# EAGLE design 100x75 BOB (EAGLE 9.6.2)
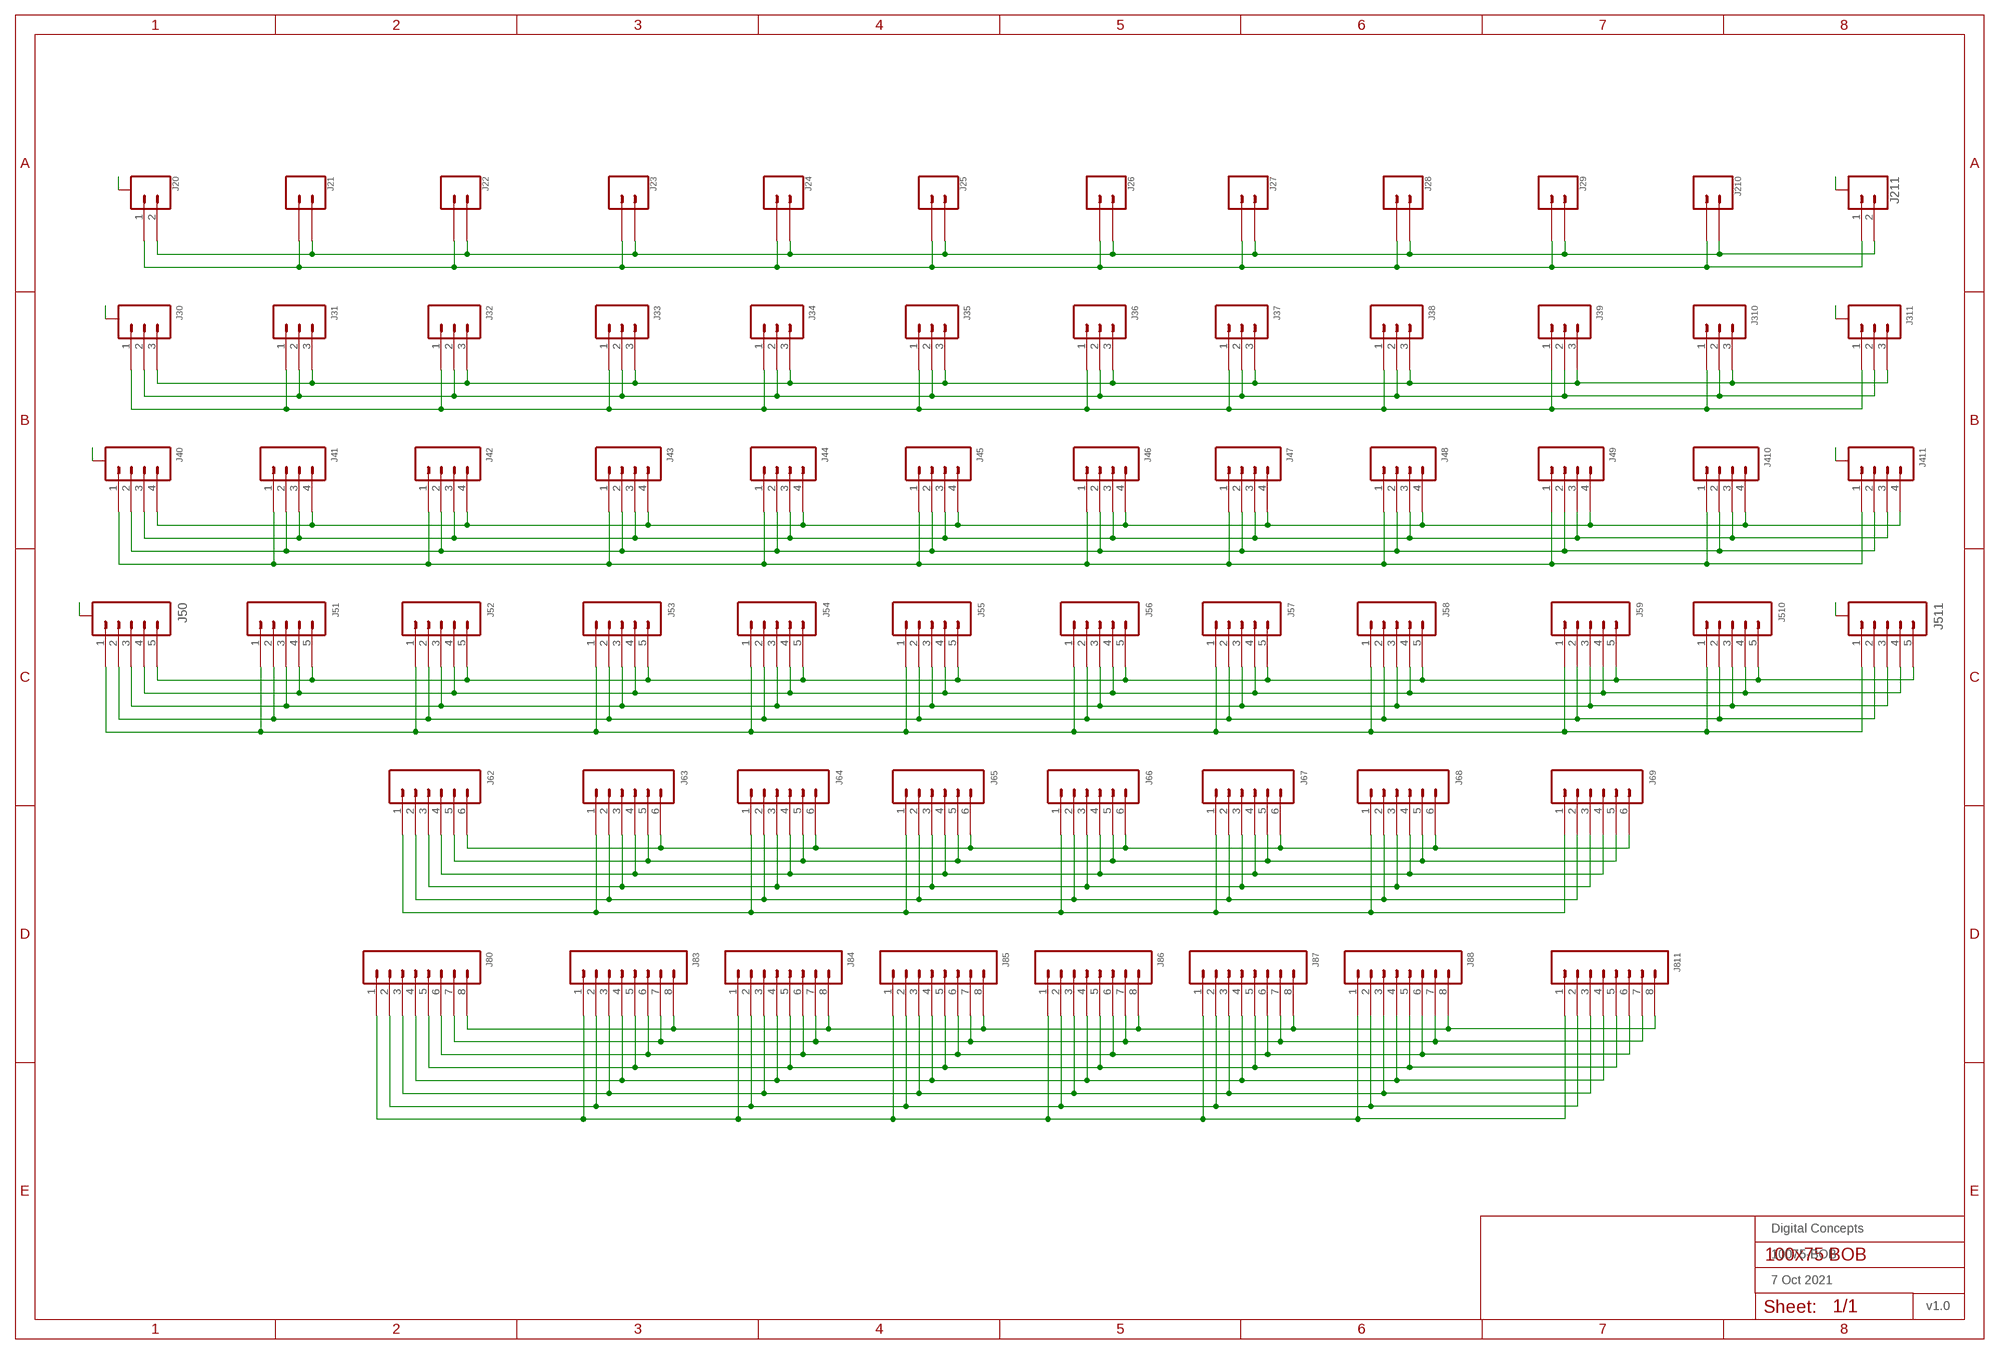
[diagram p0: schematic, sheet 1]
FRAME1 (FRAME-A3L-LOC): DATE: 7 Oct 2021; OWNER: Digital Concepts; TITLE: 10075-BOB; VERSION: v1.0

## Parts
J20  JST-SH1.0-2-SMD-VERTICAL  [JST-SH1.0-2-VERTICAL]
J21  JST-GH1.25-2-VERTICAL  [JST-GH1.25-2-VERTICAL]
J22  JST-PH2.0-2-VERTICAL  [JST-PH2.0-2-VERTICAL]
J23  HEADER-1X2-GENERIC  [CONN_02-GENERIC]
J24  HEADER-1X2-GENERIC  [CONN_02-GENERIC]
J25  HEADER-1X2-GENERIC  [CONN_02-GENERIC]
J26  HEADER-1X2-GENERIC  [CONN_02-GENERIC]
J27  HEADER-1X2-GENERIC  [CONN_02-GENERIC]
J28  HEADER-1X2-GENERIC  [CONN_02-GENERIC]
J29  JST-PH2.0-2-VERTICAL  [JST-PH2.0-2-VERTICAL]
J30  JST-SH1.0-3-SMD-VERTICAL  [JST-SH1.0-3-VERTICAL]
J31  JST-GH1.25-3-VERTICAL  [JST-GH1.25-3-VERTICAL]
J32  JST-PH2.0-3-VERTICAL  [JST-PH2.0-3-VERTICAL]
J33  HEADER-1X3-GENERIC  [CONN_03-GENERIC]
J34  HEADER-1X3-GENERIC  [CONN_03-GENERIC]
J35  HEADER-1X3-GENERIC  [CONN_03-GENERIC]
J36  HEADER-1X3-GENERIC  [CONN_03-GENERIC]
J37  HEADER-1X3-GENERIC  [CONN_03-GENERIC]
J38  HEADER-1X3-GENERIC  [CONN_03-GENERIC]
J39  JST-PH2.0-3-VERTICAL  [JST-PH2.0-3-VERTICAL]
J40  JST-SH1.0-4-SMD-VERTICAL  [JST-SH1.0-4-VERTICAL]
J41  JST-GH1.25-4-VERTICAL  [JST-GH1.25-4-VERTICAL]
J42  JST-PH2.0-4-VERTICAL  [JST-PH2.0-4-VERTICAL]
J43  HEADER-1X4-GENERIC  [CONN_04-GENERIC]
J44  HEADER-1X4-GENERIC  [CONN_04-GENERIC]
J45  HEADER-1X4-GENERIC  [CONN_04-GENERIC]
J46  HEADER-1X4-GENERIC  [CONN_04-GENERIC]
J47  HEADER-1X4-GENERIC  [CONN_04-GENERIC]
J48  HEADER-1X4-GENERIC  [CONN_04-GENERIC]
J49  JST-PH2.0-4-VERTICAL  [JST-PH2.0-4-VERTICAL]
J50  JST-SH1.0-5-SMD-VERTICAL  [JST-SH1.0-5-VERTICAL]
J51  JST-GH1.25-5-VERTICAL  [JST-GH1.25-5-VERTICAL]
J52  JST-PH2.0-5-VERTICAL  [JST-PH2.0-5-VERTICAL]
J53  HEADER-1X5-GENERIC  [CONN_05-GENERIC]
J54  HEADER-1X5-GENERIC  [CONN_05-GENERIC]
J55  HEADER-1X5-GENERIC  [CONN_05-GENERIC]
J56  HEADER-1X5-GENERIC  [CONN_05-GENERIC]
J57  HEADER-1X5-GENERIC  [CONN_05-GENERIC]
J58  HEADER-1X5-GENERIC  [CONN_05-GENERIC]
J59  JST-PH2.0-5-VERTICAL  [JST-PH2.0-5-VERTICAL]
J62  RJ11-6P6C-VERTICAL  [RJ11-6-VERTICAL]
J63  HEADER-1X6-GENERIC  [CONN_06-GENERIC]
J64  HEADER-1X6-GENERIC  [CONN_06-GENERIC]
J65  HEADER-1X6-GENERIC  [CONN_06-GENERIC]
J66  HEADER-1X6-GENERIC  [CONN_06-GENERIC]
J67  HEADER-1X6-GENERIC  [CONN_06-GENERIC]
J68  HEADER-1X6-GENERIC  [CONN_06-GENERIC]
J69  RJ11-6P6C-VERTICAL  [RJ11-6-VERTICAL]
J80  RJ45-8P8C-VERTICAL  [RJ45-VERTICAL]
J83  HEADER-1X8-GENERIC  [CONN_08-GENERIC]
J84  HEADER-1X8-GENERIC  [CONN_08-GENERIC]
J85  HEADER-1X8-GENERIC  [CONN_08-GENERIC]
J86  HEADER-1X8-GENERIC  [CONN_08-GENERIC]
J87  HEADER-1X8-GENERIC  [CONN_08-GENERIC]
J88  HEADER-1X8-GENERIC  [CONN_08-GENERIC]
J210  JST-GH1.25-2-VERTICAL  [JST-GH1.25-2-VERTICAL]
J211  JST-SH1.0-2-SMD-VERTICAL  [JST-SH1.0-2-VERTICAL]
J310  JST-GH1.25-3-VERTICAL  [JST-GH1.25-3-VERTICAL]
J311  JST-SH1.0-3-SMD-VERTICAL  [JST-SH1.0-3-VERTICAL]
J410  JST-GH1.25-4-VERTICAL  [JST-GH1.25-4-VERTICAL]
J411  JST-SH1.0-4-SMD-VERTICAL  [JST-SH1.0-4-VERTICAL]
J510  JST-GH1.25-5-VERTICAL  [JST-GH1.25-5-VERTICAL]
J511  JST-SH1.0-5-SMD-VERTICAL  [JST-SH1.0-5-VERTICAL]
J811  RJ45-8P8C-VERTICAL  [RJ45-VERTICAL]

## Nets
A: J20.A@1(A) J20.A@2(A) J30.A@1(A) J30.A@3(A) J40.A@1(A) J40.A@4(A) J50.A@1(A) J50.A@5(A) J211.A@1(A) J211.A@2(A) J311.A@1(A) J311.A@3(A) J411.A@1(A) J411.A@4(A) J511.A@1(A) J511.A@5(A)
N$1: J20.1 J21.1 J22.1 J23.1 J24.1 J25.1 J26.1 J27.1 J28.1 J29.1 J210.1 J211.1
N$2: J30.3 J31.3 J32.3 J33.3 J34.3 J35.3 J36.3 J37.3 J38.3 J39.3 J310.3 J311.3
N$3: J30.2 J31.2 J32.2 J33.2 J34.2 J35.2 J36.2 J37.2 J38.2 J39.2 J310.2 J311.2
N$4: J30.1 J31.1 J32.1 J33.1 J34.1 J35.1 J36.1 J37.1 J38.1 J39.1 J310.1 J311.1
N$5: J80.8 J83.8 J84.8 J85.8 J86.8 J87.8 J88.8 J811.8
N$6: J80.7 J83.7 J84.7 J85.7 J86.7 J87.7 J88.7 J811.7
N$7: J20.2 J21.2 J22.2 J23.2 J24.2 J25.2 J26.2 J27.2 J28.2 J29.2 J210.2 J211.2
N$8: J80.6 J83.6 J84.6 J85.6 J86.6 J87.6 J88.6 J811.6
N$9: J80.5 J83.5 J84.5 J85.5 J86.5 J87.5 J88.5 J811.5
N$10: J80.4 J83.4 J84.4 J85.4 J86.4 J87.4 J88.4 J811.4
N$11: J80.3 J83.3 J84.3 J85.3 J86.3 J87.3 J88.3 J811.3
N$12: J80.2 J83.2 J84.2 J85.2 J86.2 J87.2 J88.2 J811.2
N$13: J80.1 J83.1 J84.1 J85.1 J86.1 J87.1 J88.1 J811.1
N$14: J62.6 J63.6 J64.6 J65.6 J66.6 J67.6 J68.6 J69.6
N$15: J62.5 J63.5 J64.5 J65.5 J66.5 J67.5 J68.5 J69.5
N$16: J62.4 J63.4 J64.4 J65.4 J66.4 J67.4 J68.4 J69.4
N$17: J62.3 J63.3 J64.3 J65.3 J66.3 J67.3 J68.3 J69.3
N$18: J62.2 J63.2 J64.2 J65.2 J66.2 J67.2 J68.2 J69.2
N$19: J62.1 J63.1 J64.1 J65.1 J66.1 J67.1 J68.1 J69.1
N$20: J40.1 J41.1 J42.1 J43.1 J44.1 J45.1 J46.1 J47.1 J48.1 J49.1 J410.1 J411.1
N$21: J40.2 J41.2 J42.2 J43.2 J44.2 J45.2 J46.2 J47.2 J48.2 J49.2 J410.2 J411.2
N$22: J40.3 J41.3 J42.3 J43.3 J44.3 J45.3 J46.3 J47.3 J48.3 J49.3 J410.3 J411.3
N$23: J40.4 J41.4 J42.4 J43.4 J44.4 J45.4 J46.4 J47.4 J48.4 J49.4 J410.4 J411.4
N$25: J50.4 J51.4 J52.4 J53.4 J54.4 J55.4 J56.4 J57.4 J58.4 J59.4 J510.4 J511.4
N$26: J50.3 J51.3 J52.3 J53.3 J54.3 J55.3 J56.3 J57.3 J58.3 J59.3 J510.3 J511.3
N$27: J50.2 J51.2 J52.2 J53.2 J54.2 J55.2 J56.2 J57.2 J58.2 J59.2 J510.2 J511.2
N$28: J50.1 J51.1 J52.1 J53.1 J54.1 J55.1 J56.1 J57.1 J58.1 J59.1 J510.1 J511.1
N$30: J50.5 J51.5 J52.5 J53.5 J54.5 J55.5 J56.5 J57.5 J58.5 J59.5 J510.5 J511.5

## Library data of the parts
J20 J211 = digitalconcepts:JST-SH1.0-2-SMD-VERTICAL: JST SH1.0 2P SMD Vertical Connector
J21 J210 = digitalconcepts:JST-GH1.25-2-VERTICAL: JST GH1.25 2P PTH Connector
J22 J29 = digitalconcepts:JST-PH2.0-2-VERTICAL: PH2.0 2P Vertical Connector
J23-J28 = digitalconcepts:HEADER-1X2-GENERIC: Single Row 2-Pin Header
J30 J311 = digitalconcepts:JST-SH1.0-3-SMD-VERTICAL: JST SH1.0 3P SMD Vertical Connector
J31 J310 = digitalconcepts:JST-GH1.25-3-VERTICAL: SH1.25 3P Male PTH Connector
J32 J39 = digitalconcepts:JST-PH2.0-3-VERTICAL: PH2.0 3P Vertical Connector
J33-J38 = digitalconcepts:HEADER-1X3-GENERIC: Single Row 3-Pin Header
J40 J411 = digitalconcepts:JST-SH1.0-4-SMD-VERTICAL: JST SH1.0 SMD 4P vertical connector
J41 J410 = digitalconcepts:JST-GH1.25-4-VERTICAL: SH1.25 4P Male PTH Connector
J42 J49 = digitalconcepts:JST-PH2.0-4-VERTICAL: PH2.0 4P Vertical Connector
J43-J48 = digitalconcepts:HEADER-1X4-GENERIC: Single Row 4-Pin Header
J50 J511 = digitalconcepts:JST-SH1.0-5-SMD-VERTICAL: JST SH1.0 5P SMD Vertical Connector
J51 J510 = digitalconcepts:JST-GH1.25-5-VERTICAL: SH1.25 5P Male PTH Connector
J52 J59 = digitalconcepts:JST-PH2.0-5-VERTICAL: PH2.0 5P Vertical Connector
J53-J58 = digitalconcepts:HEADER-1X5-GENERIC: Single Row 5-Pin Header
J62 J69 = digitalconcepts:RJ11-6P6C-VERTICAL: RJ11-6P6C-Vertical PCB Socket
J63-J68 = digitalconcepts:HEADER-1X6-GENERIC: Single Row 6-Pin Header
J80 J811 = digitalconcepts:RJ45-8P8C-VERTICAL: RJ45-8P8C-Vertical PCB Socket
J83-J88 = digitalconcepts:HEADER-1X8-GENERIC: Single Row 8-Pin Header

## Board
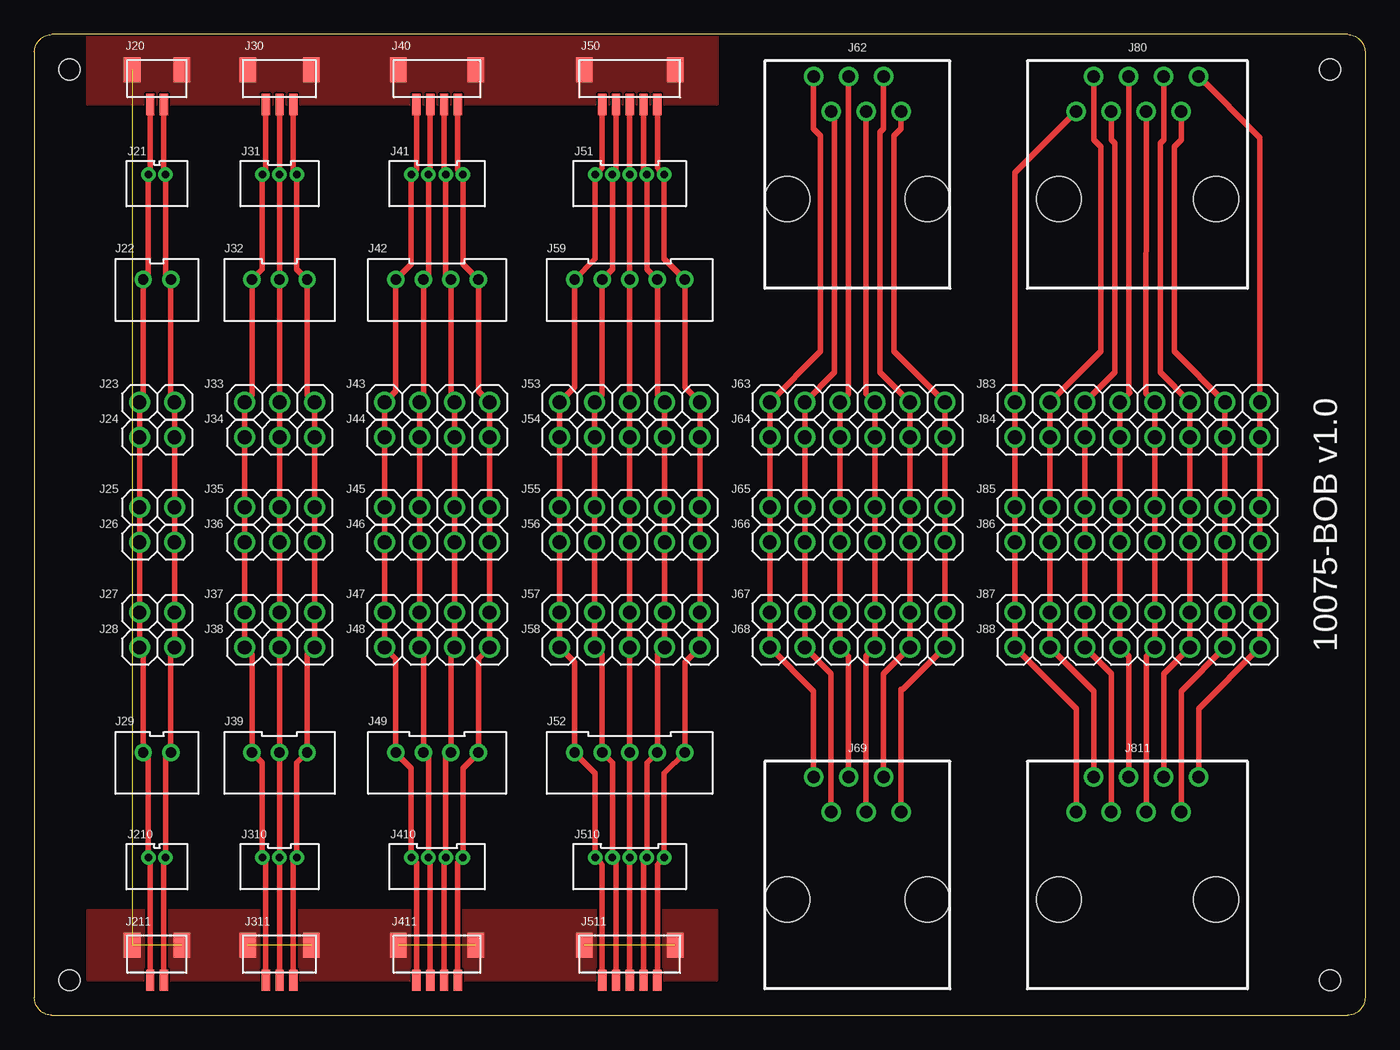
[diagram p1: board, top side]
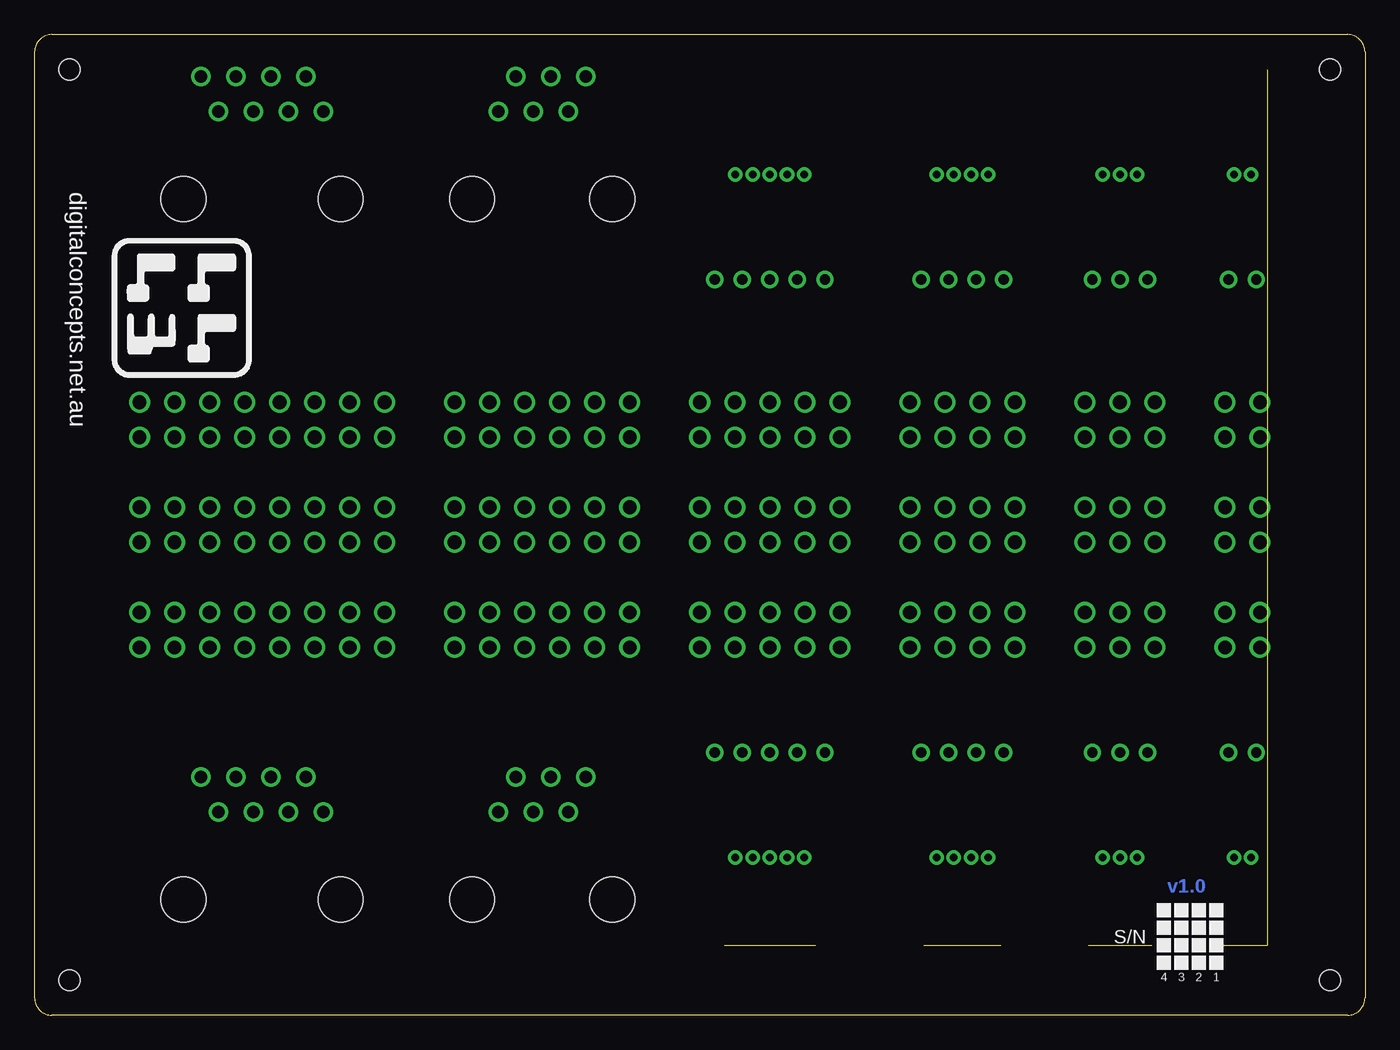
[diagram p2: board, bottom side, seen from below]

Size 96.52 x 71.12 mm. Coordinates in mm from the lower left corner, seen from the top.
Outline: 95.25,71.12 arc-90 96.52,69.85 96.52,1.27 arc-90 95.25,0 1.27,0 arc-90 0,1.27 0,69.85 arc-90 1.27,71.12 95.25,71.12
Copper layers (1*16): Top 0.035mm / dielectric 1.5mm / Bottom 0.035mm
Design rules "default *": minimum track width 6mil, minimum drill 0.35mm, track to track 6mil, track to pad 6mil, pad to pad 6mil, via to via 6mil, smd to smd 6mil, copper to edge 6mil, drill to drill 6mil, minimum pad ring 10mil, minimum via ring 8mil, stop-mask expansion 4mil, vias tented up to drill 0mil, thermal gap 0mil
Holes 1.52 mm at 2.54,68.58 2.54,2.54 93.98,2.54 93.98,68.58

### Footprints (pad centres in the part's own frame; a part is rotated, then mirrored left to right if it is on the bottom)
JST-SH1.0-2-VERTICAL = smd 0.6 x 1.55: 1 -0.5,-2.54; 2 0.5,-2.54 | smd 1.2 x 1.8: A@1 -1.8,-0.015; A@2 1.8,-0.015
JST-GH1.25-2-VERTICAL = drill 0.55 pad 1.016: 1 -0.625,0; 2 0.625,0
JST-PH2.0-2-VERTICAL = drill 0.75: 1 -1,0; 2 1,0
CONN_02-GENERIC = drill 1 pad 1.524: 1 0,0; 2 2.54,0
JST-SH1.0-3-VERTICAL = smd 0.6 x 1.55: 1 -1,-2.54; 2 0,-2.54; 3 1,-2.54 | smd 1.2 x 1.8: A@1 -2.3,-0.015; A@3 2.3,-0.015
JST-GH1.25-3-VERTICAL = drill 0.55 pad 1.016: 1 -1.25,0; 2 0,0; 3 1.25,0
JST-PH2.0-3-VERTICAL = drill 0.75: 1 -2,0; 2 0,0; 3 2,0
CONN_03-GENERIC = drill 1 pad 1.524: 1 0,0; 2 2.54,0; 3 5.08,0
JST-SH1.0-4-VERTICAL = smd 0.6 x 1.55: 1 -1.5,-2.54; 2 -0.5,-2.54; 3 0.5,-2.54; 4 1.5,-2.54 | smd 1.2 x 1.8: A@1 -2.8,-0.015; A@4 2.8,-0.015
JST-GH1.25-4-VERTICAL = drill 0.55 pad 1.016: 1 -1.875,0; 2 -0.625,0; 3 0.625,0; 4 1.875,0
JST-PH2.0-4-VERTICAL = drill 0.75: 1 -3,0; 2 -1,0; 3 1,0; 4 3,0
CONN_04-GENERIC = drill 1 pad 1.524: 1 0,0; 2 2.54,0; 3 5.08,0; 4 7.62,0
JST-SH1.0-5-VERTICAL = smd 0.6 x 1.55: 1 -2,-2.54; 2 -1,-2.54; 3 0,-2.54; 4 1,-2.54; 5 2,-2.54 | smd 1.2 x 1.8: A@1 -3.3,-0.015; A@5 3.3,-0.015
JST-GH1.25-5-VERTICAL = drill 0.55 pad 1.016: 1 -2.5,0; 2 -1.25,0; 3 0,0; 4 1.25,0; 5 2.5,0
JST-PH2.0-5-VERTICAL = drill 0.75: 1 -4,0; 2 -2,0; 3 0,0; 4 2,0; 5 4,0
CONN_05-GENERIC = drill 1 pad 1.524: 1 0,0; 2 2.54,0; 3 5.08,0; 4 7.62,0; 5 10.16,0
RJ11-6-VERTICAL = drill 0.9: 1 -3.175,7.12; 2 -1.905,4.58; 3 -0.635,7.12; 4 0.635,4.58; 5 1.905,7.12; 6 3.175,4.58 | hole 3.25: -5.08,-1.77; 5.08,-1.77
CONN_06-GENERIC = drill 1 pad 1.524: 1 0,0; 2 2.54,0; 3 5.08,0; 4 7.62,0; 5 10.16,0; 6 12.7,0
RJ45-VERTICAL = drill 0.9: 1 -4.445,4.58; 2 -3.175,7.12; 3 -1.905,4.58; 4 -0.635,7.12; 5 0.635,4.58; 6 1.905,7.12; 7 3.175,4.58; 8 4.445,7.12 | hole 3.25: -5.71,-1.77; 5.71,-1.77
CONN_08-GENERIC = drill 1 pad 1.524: 1 0,0; 2 2.54,0; 3 5.08,0; 4 7.62,0; 5 10.16,0; 6 12.7,0; 7 15.24,0; 8 17.78,0

### Placement (x,y rotation side)
J20  8.89,68.58 0 top
J21  8.89,60.96 0 top
J22  8.89,53.34 0 top
J23  7.62,44.45 0 top
J24  7.62,41.91 0 top
J25  7.62,36.83 0 top
J26  7.62,34.29 0 top
J27  7.62,29.21 0 top
J28  7.62,26.67 0 top
J29  8.89,19.05 0 top
J30  17.78,68.58 0 top
J31  17.78,60.96 0 top
J32  17.78,53.34 0 top
J33  15.24,44.45 0 top
J34  15.24,41.91 0 top
J35  15.24,36.83 0 top
J36  15.24,34.29 0 top
J37  15.24,29.21 0 top
J38  15.24,26.67 0 top
J39  17.78,19.05 0 top
J40  29.21,68.58 0 top
J41  29.21,60.96 0 top
J42  29.21,53.34 0 top
J43  25.4,44.45 0 top
J44  25.4,41.91 0 top
J45  25.4,36.83 0 top
J46  25.4,34.29 0 top
J47  25.4,29.21 0 top
J48  25.4,26.67 0 top
J49  29.21,19.05 0 top
J50  43.18,68.58 0 top
J51  43.18,60.96 0 top
J52  43.18,19.05 0 top
J53  38.1,44.45 0 top
J54  38.1,41.91 0 top
J55  38.1,36.83 0 top
J56  38.1,34.29 0 top
J57  38.1,29.21 0 top
J58  38.1,26.67 0 top
J59  43.18,53.34 0 top
J62  59.69,60.96 0 top
J63  53.34,44.45 0 top
J64  53.34,41.91 0 top
J65  53.34,36.83 0 top
J66  53.34,34.29 0 top
J67  53.34,29.21 0 top
J68  53.34,26.67 0 top
J69  59.69,10.16 0 top
J80  80.01,60.96 0 top
J83  71.12,44.45 0 top
J84  71.12,41.91 0 top
J85  71.12,36.83 0 top
J86  71.12,34.29 0 top
J87  71.12,29.21 0 top
J88  71.12,26.67 0 top
J210  8.89,11.43 0 top
J211  8.89,5.08 0 top
J310  17.78,11.43 0 top
J311  17.78,5.08 0 top
J410  29.21,11.43 0 top
J411  29.21,5.08 0 top
J510  43.18,11.43 0 top
J511  43.18,5.08 0 top
J811  80.01,10.16 0 top

### Tracks (layer width: path | path; a pad name or v marks a point on that pad's centre or on a via)
A  (5 unrouted)
  pour Top: 3.81,71.12 49.53,71.12 49.53,66.04 3.81,66.04
  pour Top: 3.81,2.54 49.53,2.54 49.53,7.62 3.81,7.62
N$1
  Top 0.406: J20.1 8.39,61.09 J21.1 8.27,53.72 J22.1 7.89,44.72 J23.1 J24.1 J25.1 J26.1 J27.1 J28.1 7.89,26.4 J29.1 8.27,18.68 J210.1 8.39,11.3 J211.1
N$2
  Top 0.406: J30.3 18.78,61.21 J31.3 19.03,54.09 J32.3 19.78,44.99 J33.3 J34.3 J35.3 J36.3 J37.3 J38.3 19.78,26.13 J39.3 19.03,18.3 J310.3 18.78,11.18 J311.3
N$3
  Top 0.406: J30.2 J31.2 J32.2 J33.2 J34.2 J35.2 J36.2 J37.2 J38.2 J39.2 J310.2 J311.2
N$4
  Top 0.406: J30.1 16.78,61.21 J31.1 16.53,54.09 J32.1 15.78,44.99 J33.1 J34.1 J35.1 J36.1 J37.1 J38.1 15.78,26.13 J39.1 16.51,18.32 16.51,11.45 J310.1 16.78,11.18 J311.1
N$5
  Top 0.406: J80.8 88.9,63.63 J83.8 J84.8 J85.8 J86.8 J87.8 J88.8 84.45,22.23 J811.8
N$6
  Top 0.406: J80.7 83.19,63.5 82.68,62.99 82.68,48.13 J83.7 J84.7 J85.7 J86.7 J87.7 J88.7 83.19,23.5 J811.7
N$7
  Top 0.406: J20.2 9.39,61.09 J21.2 9.52,53.72 J22.2 9.89,44.72 J23.2 J24.2 J25.2 J26.2 J27.2 J28.2 9.89,26.4 J29.2 9.52,18.68 J210.2 9.39,11.3 J211.2
N$8
  Top 0.406: J80.6 81.92,63.5 81.66,63.25 81.66,46.61 J83.6 J84.6 J85.6 J86.6 J87.6 J88.6 81.92,24.77 J811.6
N$9
  Top 0.406: J80.5 80.64,45.09 J83.5 J84.5 J85.5 J86.5 J87.5 J88.5 80.64,26.04 J811.5
N$10
  Top 0.406: J80.4 79.38,45.22 79.44,45.15 J83.4 J84.4 J85.4 J86.4 J87.4 J88.4 79.38,26.04 J811.4
N$11
  Top 0.406: J80.3 78.11,63.5 78.36,63.25 78.36,46.61 J83.3 J84.3 J85.3 J86.3 J87.3 J88.3 78.11,24.77 J811.3
N$12
  Top 0.406: J80.2 76.83,63.5 77.34,62.99 77.34,48.13 J83.2 J84.2 J85.2 J86.2 J87.2 J88.2 76.83,23.5 J811.2
N$13
  Top 0.406: J80.1 71.12,61.09 J83.1 J84.1 J85.1 J86.1 J87.1 J88.1 75.56,22.23 J811.1
N$14
  Top 0.406: J62.6 62.87,64.27 62.36,63.76 62.36,48.13 J63.6 J64.6 J65.6 J66.6 J67.6 J68.6 63,23.63 62.87,23.63 J69.6
N$15
  Top 0.406: J62.5 61.59,64.27 61.34,64.02 61.34,46.61 J63.5 J64.5 J65.5 J66.5 J67.5 J68.5 61.59,24.77 J69.5
N$16
  Top 0.406: J62.4 60.33,45.09 J63.4 J64.4 J65.4 J66.4 J67.4 J68.4 60.33,26.04 J69.4
N$17
  Top 0.406: J62.3 59.05,45.09 J63.3 J64.3 J65.3 J66.3 J67.3 J68.3 59.05,26.04 J69.3
N$18
  Top 0.406: J62.2 58.04,65.29 58.04,46.61 J63.2 J64.2 J65.2 J66.2 J67.2 J68.2 57.78,24.77 J69.2
N$19
  Top 0.406: J62.1 56.52,64.27 57.02,63.76 57.02,48.13 J63.1 J64.1 J65.1 J66.1 J67.1 J68.1 56.52,23.5 J69.1
N$20
  Top 0.406: J40.1 27.71,61.34 27.7,61.33 J41.1 27.34,54.47 J42.1 26.21,45.26 J43.1 J44.1 J45.1 J46.1 J47.1 J48.1 26.21,25.86 J49.1 27.34,17.93 J410.1 27.7,11.06 27.71,11.05 J411.1
N$21
  Top 0.406: J40.2 28.71,61.09 J41.2 28.59,53.72 J42.2 28.21,44.72 J43.2 J44.2 J45.2 J46.2 J47.2 J48.2 28.21,26.4 J49.2 28.59,18.68 J410.2 28.71,11.3 J411.2
N$22
  Top 0.406: J40.3 29.71,61.09 J41.3 29.84,53.72 J42.3 30.21,44.72 J43.3 J44.3 J45.3 J46.3 J47.3 J48.3 30.21,26.4 J49.3 29.84,18.68 J410.3 29.71,11.3 J411.3
N$23
  Top 0.406: J40.4 30.71,61.34 30.72,61.33 J41.4 31.09,54.47 J42.4 32.21,45.26 J43.4 J44.4 J45.4 J46.4 J47.4 J48.4 32.21,25.86 J49.4 31.09,17.93 J410.4 30.72,11.06 30.71,11.05 J411.4
N$25
  Top 0.406: J50.4 44.18,61.21 J51.4 44.43,54.09 J59.4 45.18,44.99 J53.4 J54.4 J55.4 J56.4 J57.4 J58.4 45.18,26.13 J52.4 44.43,18.3 J510.4 44.18,11.18 J511.4
N$26
  Top 0.406: J50.3 J51.3 J59.3 J53.3 J54.3 J55.3 J56.3 J57.3 J58.3 J52.3 J510.3 J511.3
N$27
  Top 0.406: J50.2 42.18,61.21 J51.2 41.93,54.09 J59.2 41.18,44.99 J53.2 J54.2 J55.2 J56.2 J57.2 J58.2 41.18,26.13 J52.2 41.93,18.3 J510.2 42.18,11.18 J511.2
N$28
  Top 0.406: J50.1 41.18,61.46 41.05,61.33 J51.1 40.68,54.84 J59.1 39.18,45.53 J53.1 J54.1 J55.1 J56.1 J57.1 J58.1 39.18,25.59 J52.1 40.68,17.55 J510.1 41.05,11.06 41.18,10.93 J511.1
N$30
  Top 0.406: J50.5 45.18,61.46 45.31,61.33 J51.5 45.68,54.84 J59.5 47.18,45.53 J53.5 J54.5 J55.5 J56.5 J57.5 J58.5 47.18,25.59 J52.5 45.68,17.55 J510.5 45.31,11.06 45.18,10.93 J511.5

### Text on the board
Bottom: v1.0
tPlace: 10075-BOB v1.0
bPlace: digitalconcepts.net.au | S/N | 1 | 2 | 3 | 4